# Altium schematic sheet Overview.SchDoc
size A3; SheetNumber: 1; SheetTotal: 2
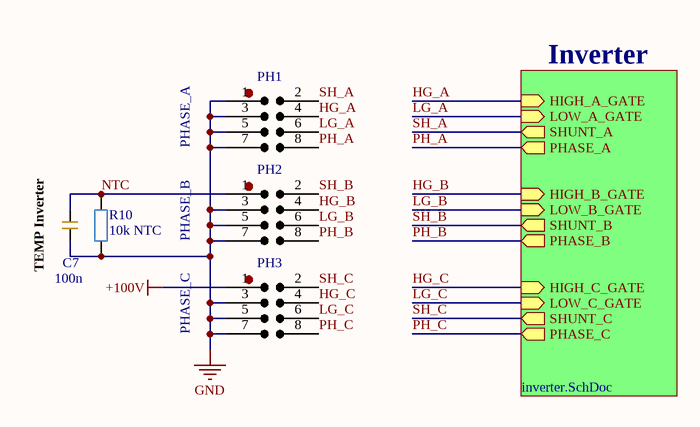
[diagram p0: Overview.SchDoc]

## Parts
C7  100n  [CAP_0603]
PH1  PHASE_A  [PH_2x4_F]
PH2  PHASE_B  [PH_2x4_F]
PH3  PHASE_C  [PH_2x4_F]
R10  10k NTC  [RES_0603]

## Sub-sheets
Inverter = inverter.SchDoc: HIGH_C_GATE (in), LOW_C_GATE (in), HIGH_B_GATE (in), LOW_B_GATE (in), HIGH_A_GATE (in), LOW_A_GATE (in), SHUNT_C (out), SHUNT_B (out), SHUNT_A (out), PHASE_A (out), PHASE_B (out), PHASE_C (out)

## Nets
+100V: PH3.1
GND: C7.1 PH1.1 PH1.3 PH1.5 PH1.7 PH2.3 PH2.5 PH2.7 PH3.3 PH3.5 PH3.7 R10.1
HG_A: PH1.4 ; sheet Inverter/HIGH_A_GATE
HG_B: PH2.4 ; sheet Inverter/HIGH_B_GATE
HG_C: PH3.4 ; sheet Inverter/HIGH_C_GATE
LG_A: PH1.6 ; sheet Inverter/LOW_A_GATE
LG_B: PH2.6 ; sheet Inverter/LOW_B_GATE
LG_C: PH3.6 ; sheet Inverter/LOW_C_GATE
NTC: C7.2 PH2.1 R10.2
PH_A: PH1.8 ; sheet Inverter/PHASE_A
PH_B: PH2.8 ; sheet Inverter/PHASE_B
PH_C: PH3.8 ; sheet Inverter/PHASE_C
SH_A: PH1.2 ; sheet Inverter/SHUNT_A
SH_B: PH2.2 ; sheet Inverter/SHUNT_B
SH_C: PH3.2 ; sheet Inverter/SHUNT_C

## Notes on the sheet
- (near C7) TEMP Inverter

## Library data of the parts
C7 = CAP_0603: Multilayer Ceramic Capacitors MLCC - SMD/SMT ROHS; Mfr.: *; Voltage Rating: *; Package: 0603; LCSC: *; Mfr. Part: *
PH1-PH3 = PH_2x4_F: 2.54mm 2.54mm Double Row 3A Copper alloy 10P -40℃~+105℃ Bend-in 2x5P Side 8.5mm Square Hole Push-Pull,P=2.54mm Female Headers ROHS; Mfr.: HCTL; Mfr. Part: PM254-2-04-W-8.5; LCSC: C2897424
R10 = RES_0603: 100mW Thick Film Resistors; Voltage Rating: *; Mfr. Part: *; Package: 0603; LCSC: *; Mfr.: *